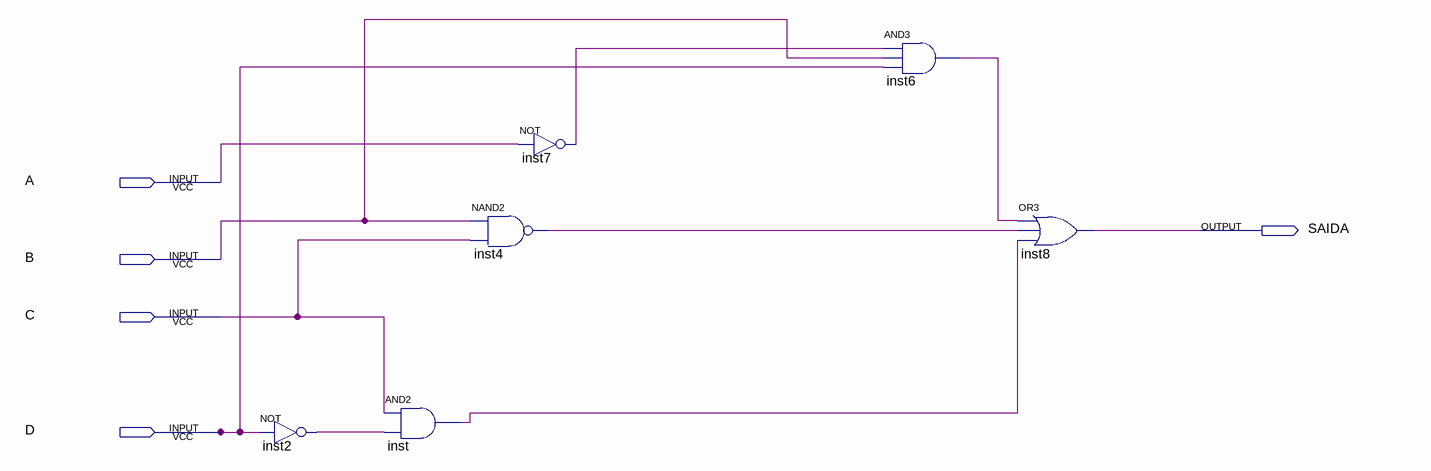
[diagram p0: schematic sheet]
// Quartus schematic TrabalhoCircuitos.bdf as structural Verilog: 6 symbols, 5 pins
module TrabalhoCircuitos (
  input  A,
  input  B,
  input  C,
  input  D,
  output SAIDA
);

  wire inst2_out, inst4_out, inst6_out, inst7_out, inst_out;

  not inst2 (inst2_out, D);
  and inst (inst_out, C, inst2_out);
  nand inst4 (inst4_out, B, C);
  not inst7 (inst7_out, A);
  and inst6 (inst6_out, inst7_out, B, D);
  or inst8 (SAIDA, inst6_out, inst4_out, inst_out);
endmodule
